# Altium schematic sheet Mainboard_JTAG Connector.SchDoc
size A4
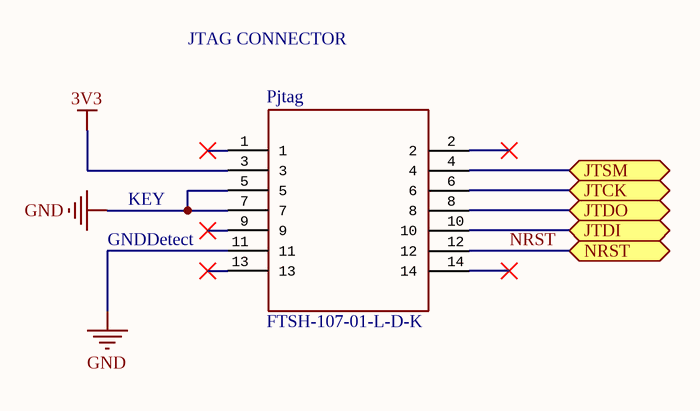
[diagram p0: Mainboard_JTAG Connector.SchDoc]

## Parts
Pjtag  FTSH-107-01-L-D-K  [CN HDR JTAG]

## Ports
JTCK (bidir), JTDI (bidir), JTDO (bidir), JTSM (bidir), NRST (bidir)

## Nets
3V3: Pjtag.3
GND: Pjtag.5 Pjtag.7 Pjtag.11
JTCK: Pjtag.6 ; port JTCK
JTDI: Pjtag.10 ; port JTDI
JTDO: Pjtag.8 ; port JTDO
JTSM: Pjtag.4 ; port JTSM
NRST: Pjtag.12 ; port NRST

Not connected (* = marked no-connect by the designer): Pjtag 1* 2* 9* 13* 14*

## Notes on the sheet
- JTAG CONNECTOR
- KEY
- (near Pjtag) GNDDetect

## Library data of the parts
Pjtag = CN HDR JTAG: Connector Header Through Hole 14 position 0.050" (1.27mm); MF: Samtec Inc.; Rating: 3.4A; ComponentLink1Description: Digikey; ComponentLink1URL: https://www.digikey.ca/product-detail/en/samtec-inc/FTSH-107-01-L-D-K/612-FTSH-107-01-L-D-K-ND/6693516; ComponentLink2Description: Datasheet; ComponentLink2URL: https://www.digikey.ca/en/datasheets/samtecinc/samtec-inc-ftsh-1xx-xx-xx-d-xx-xx-mkt; Digikey: 612-FTSH-107-01-L-D-K-ND; Digikey Link: https://www.digikey.ca/product-detail/en/samtec-inc/FTSH-107-01-L-D-K/612-FTSH-107-01-L-D-K-ND/6693516; MP: FTSH-107-01-L-D-K; Price: 5.14000 CAD